# Altium schematic sheet filtro_in.SchDoc
size A4
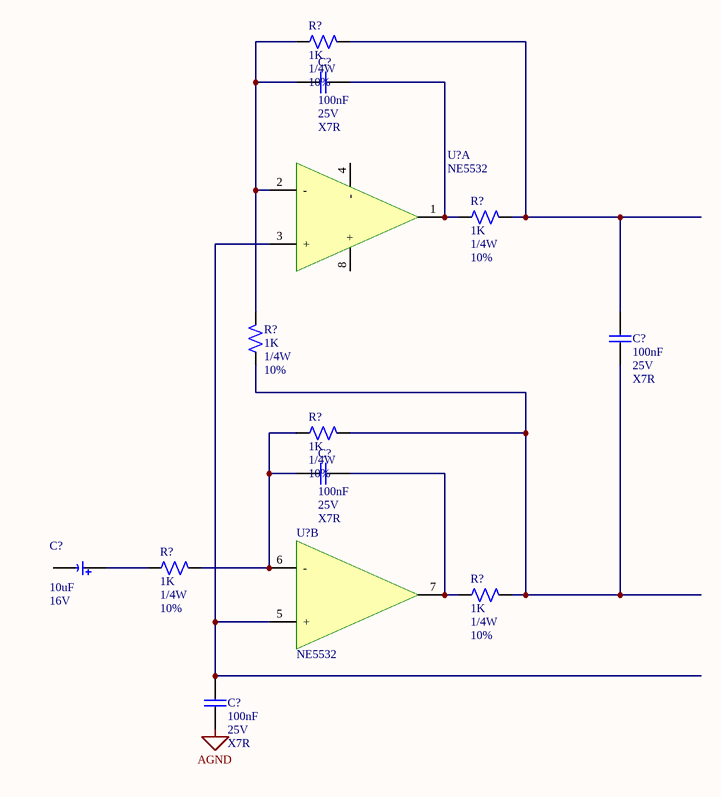
[diagram p0: filtro_in.SchDoc]

## Parts
(Parts that share a designator on the sheet are numbered #1, #2 ... from top to bottom, then left to right.)
C?#1  valor: 100nF  tension: 25V  tolerancia: X7R  [C0805]  (hidden comment: Capacitor)
C?#2  valor: 100nF  tension: 25V  tolerancia: X7R  [C0805]  (hidden comment: Capacitor)
C?#3  valor: 100nF  tension: 25V  tolerancia: X7R  [C0805]  (hidden comment: Capacitor)
C?#4  valor: 10uF  tension: 16V  [AVX_C]  (hidden comment: Capacitor polarizado)
C?#5  valor: 100nF  tension: 25V  tolerancia: X7R  [C0805]  (hidden comment: Capacitor)
R?#1  Valor: 1K  Potencia: 1/4W  Tolerancia: 10%  [R0603]  (hidden comment: Resistor)
R?#2  Valor: 1K  Potencia: 1/4W  Tolerancia: 10%  [R0603]  (hidden comment: Resistor)
R?#3  Valor: 1K  Potencia: 1/4W  Tolerancia: 10%  [R0603]  (hidden comment: Resistor)
R?#4  Valor: 1K  Potencia: 1/4W  Tolerancia: 10%  [R0603]  (hidden comment: Resistor)
R?#5  Valor: 1K  Potencia: 1/4W  Tolerancia: 10%  [R0603]  (hidden comment: Resistor)
R?#6  Valor: 1K  Potencia: 1/4W  Tolerancia: 10%  [R0603]  (hidden comment: Resistor)
U?#1  NE5532  [D8]  (part A of 2)
U?#2  NE5532  [D8]  (part B of 2)

## Nets
AGND: C?#5.2
NetC?#1_1: C?#1.1 R?#2.1 U?#1.1(OUT)
NetC?#1_2: C?#1.2 R?#1.1 R?#3.2 U?#1.2(-)
NetC?#2_1: C?#2.1 R?#1.2 R?#2.2
NetC?#2_2: C?#2.2 R?#3.1 R?#4.2 R?#6.2
NetC?#3_1: C?#3.1 R?#6.1 U?#2.7(OUT)
NetC?#3_2: C?#3.2 R?#4.1 R?#5.2 U?#2.6(-)
NetC?#4_1: C?#4.1 R?#5.1
NetC?#5_1: C?#5.1 U?#1.3(+) U?#2.5(+)

Not connected (* = marked no-connect by the designer): C?#4 2; U?#1 4(-) 8(+)

## Library data of the parts
C?#1-C?#3 C?#5 = Capacitor: Capacitor de placas paralelas; Encapsulado: 0805
R?#1-R?#6 = Resistor: Resistencia
U?#1 U?#2 = NE5532: Integrado con 4 operacionales